# EAGLE schematic PIDController (EAGLE 8.7.1)
CNAME: Jamilla Akhund-Zade/de Bivort Lab
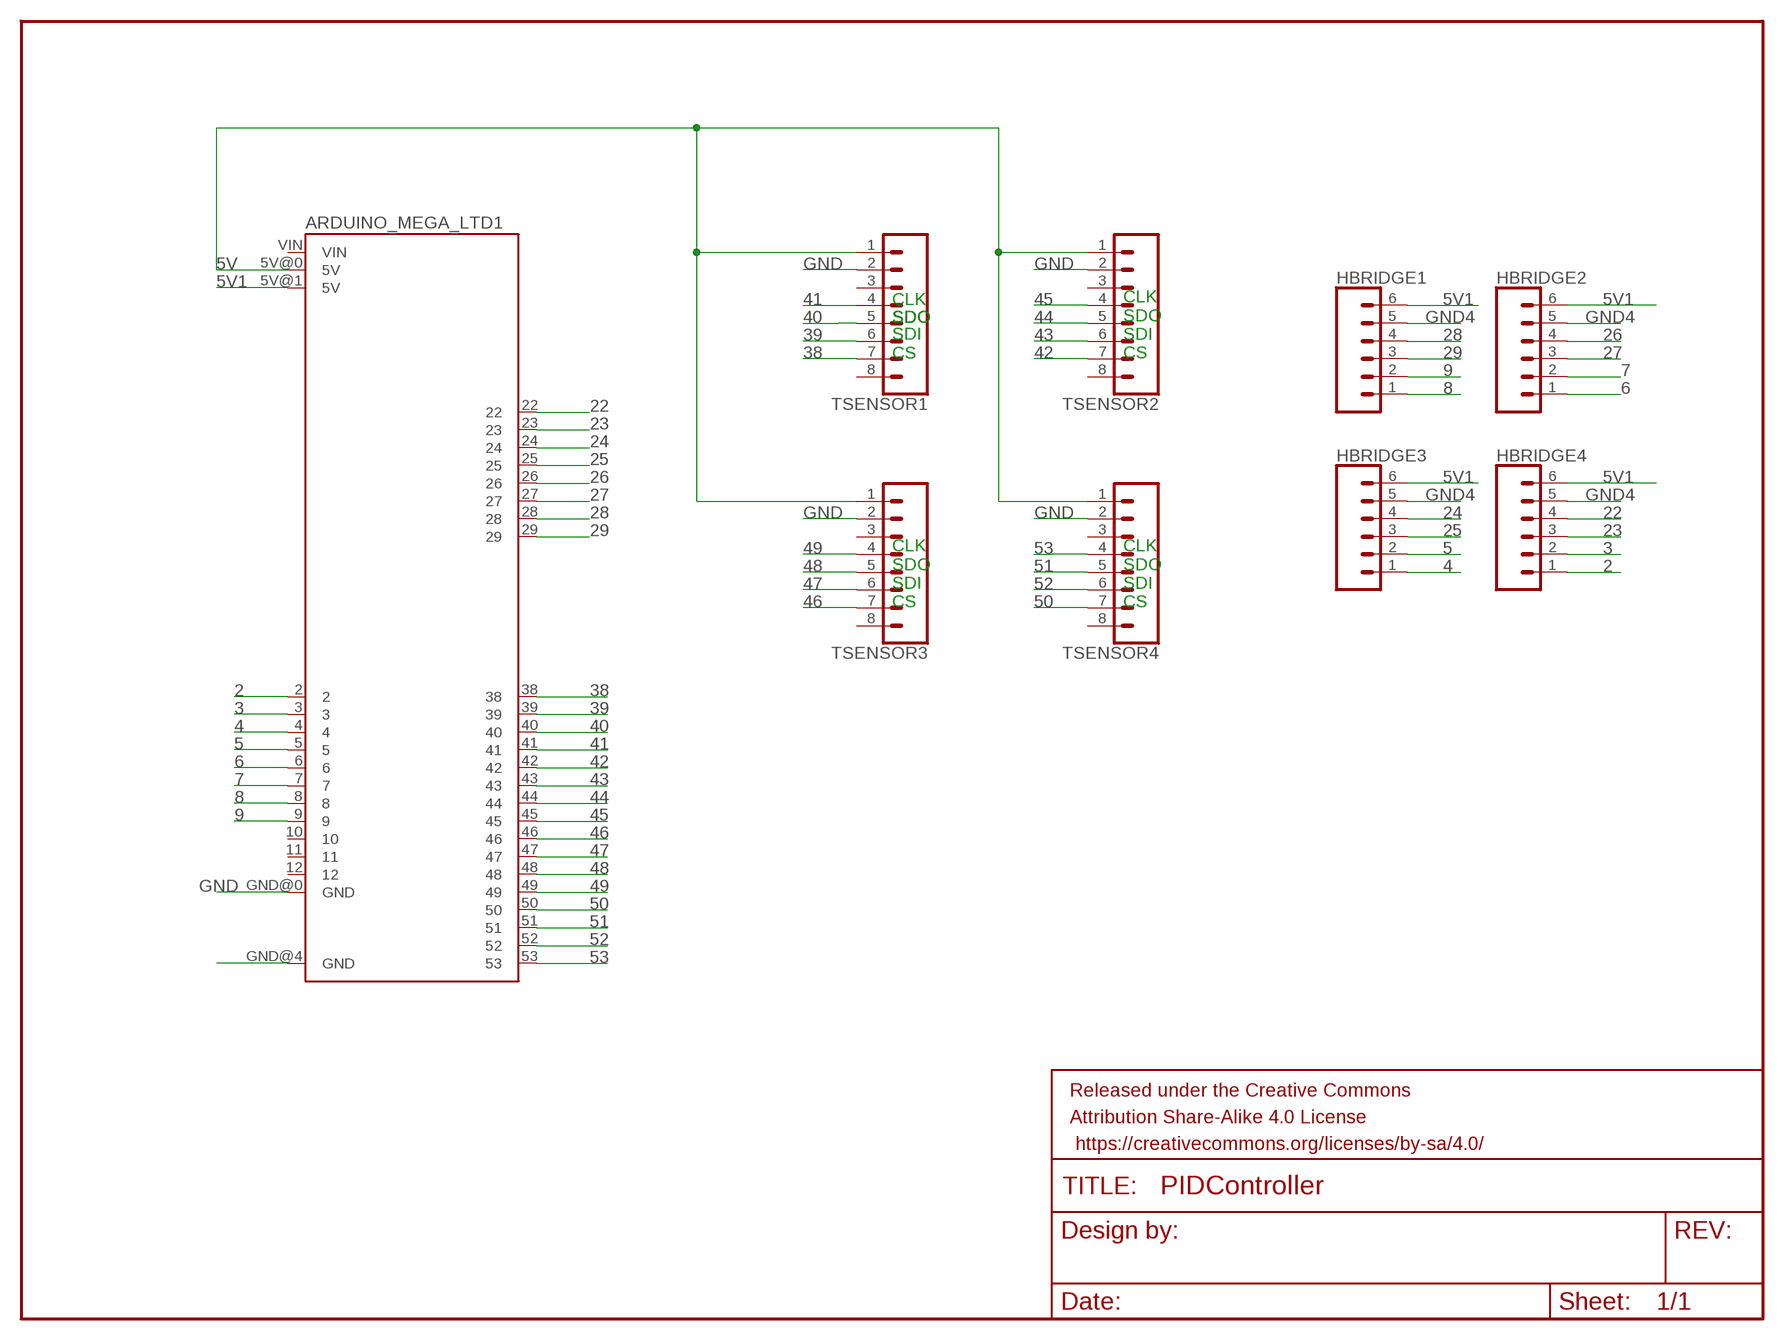
[diagram p0: schematic, sheet 1]

## Parts
ARDUINO_MEGA_LTD1  ARDUINO_MEGA_LTD  [ARDUINO_MEGA_LTD]
FRAME2  FRAME-LETTERNO_PACKAGE  [DUMMY]
HBRIDGE1  CONN_06LONGPADS  [1X06_LONGPADS]
HBRIDGE2  CONN_06LONGPADS  [1X06_LONGPADS]
HBRIDGE3  CONN_06LONGPADS  [1X06_LONGPADS]
HBRIDGE4  CONN_06LONGPADS  [1X06_LONGPADS]
TSENSOR1  CONN_08"  [1X08]
TSENSOR2  CONN_08"  [1X08]
TSENSOR3  CONN_08"  [1X08]
TSENSOR4  CONN_08"  [1X08]

## Nets
2: ARDUINO_MEGA_LTD1.2 HBRIDGE4.1
3: ARDUINO_MEGA_LTD1.3 HBRIDGE4.2
4: ARDUINO_MEGA_LTD1.4 HBRIDGE3.1
5: ARDUINO_MEGA_LTD1.5 HBRIDGE3.2
5V: ARDUINO_MEGA_LTD1.5V@0(5V) TSENSOR1.1 TSENSOR2.1 TSENSOR3.1 TSENSOR4.1
5V1: ARDUINO_MEGA_LTD1.5V@1(5V) HBRIDGE1.6 HBRIDGE2.6 HBRIDGE3.6 HBRIDGE4.6
6: ARDUINO_MEGA_LTD1.6 HBRIDGE2.1
7: ARDUINO_MEGA_LTD1.7 HBRIDGE2.2
8: ARDUINO_MEGA_LTD1.8 HBRIDGE1.1
9: ARDUINO_MEGA_LTD1.9 HBRIDGE1.2
22: ARDUINO_MEGA_LTD1.22 HBRIDGE4.4
23: ARDUINO_MEGA_LTD1.23 HBRIDGE4.3
24: ARDUINO_MEGA_LTD1.24 HBRIDGE3.4
25: ARDUINO_MEGA_LTD1.25 HBRIDGE3.3
26: ARDUINO_MEGA_LTD1.26 HBRIDGE2.4
27: ARDUINO_MEGA_LTD1.27 HBRIDGE2.3
28: ARDUINO_MEGA_LTD1.28 HBRIDGE1.4
29: ARDUINO_MEGA_LTD1.29 HBRIDGE1.3
38: ARDUINO_MEGA_LTD1.38 TSENSOR1.7
39: ARDUINO_MEGA_LTD1.39 TSENSOR1.6
40: ARDUINO_MEGA_LTD1.40 TSENSOR1.5
41: ARDUINO_MEGA_LTD1.41 TSENSOR1.4
42: ARDUINO_MEGA_LTD1.42 TSENSOR2.7
43: ARDUINO_MEGA_LTD1.43 TSENSOR2.6
44: ARDUINO_MEGA_LTD1.44 TSENSOR2.5
45: ARDUINO_MEGA_LTD1.45 TSENSOR2.4
46: ARDUINO_MEGA_LTD1.46 TSENSOR3.7
47: ARDUINO_MEGA_LTD1.47 TSENSOR3.6
48: ARDUINO_MEGA_LTD1.48 TSENSOR3.5
49: ARDUINO_MEGA_LTD1.49 TSENSOR3.4
50: ARDUINO_MEGA_LTD1.50 TSENSOR4.7
51: ARDUINO_MEGA_LTD1.51 TSENSOR4.5
52: ARDUINO_MEGA_LTD1.52 TSENSOR4.6
53: ARDUINO_MEGA_LTD1.53 TSENSOR4.4
GND: ARDUINO_MEGA_LTD1.GND@0(GND) TSENSOR1.2 TSENSOR2.2 TSENSOR3.2 TSENSOR4.2
GND4: ARDUINO_MEGA_LTD1.GND@4(GND) HBRIDGE1.5 HBRIDGE2.5 HBRIDGE3.5 HBRIDGE4.5
Unconnected: ARDUINO_MEGA_LTD1.10 ARDUINO_MEGA_LTD1.11 ARDUINO_MEGA_LTD1.12 ARDUINO_MEGA_LTD1.VIN TSENSOR1.3 TSENSOR1.8 TSENSOR2.3 TSENSOR2.8 TSENSOR3.3 TSENSOR3.8 TSENSOR4.3 TSENSOR4.8

## Notes on the sheet
- CLK
- SDO | SDO
- SDI
  CS
- CLK
  SDO
  SDI
  CS
- CLK
  SDO
  SDI
  CS
- CLK
  SDO
  SDI
  CS

## Library data of the parts
ARDUINO_MEGA_LTD1 = Arduino_Mega_LTD:ARDUINO_MEGA_LTD
FRAME2 = SparkFun-Aesthetics:FRAME-LETTER: Schematic Frame - Letter Standard 8.5x11 US Letter frame; DESIGNER: Jamilla Akhund-Zade, de Bivort Lab; VERSION: v01
HBRIDGE1-HBRIDGE4 = SparkFun-Connectors:CONN_06: Multi connection point. Often used as Generic Header-pin footprint for 0.1 inch spaced/style header connections On any of the 0.1 inch spaced packages, you can populate with these: Break Away Headers - Straight <https://www.sparkfun.com/products/116> (PRT-00116) Break Away Male Headers - Right Angle <https://www.sparkfun.com/products/553> (PRT-00553) Female Headers <https://www.sparkfun.com/products/115> (PRT-00115) Break Away Headers - Machine Pin <https://www.sparkfun.com/products/117> (PRT-00117) Break Away Female Headers - Swiss Machine Pin <https://www.sparkfun.com/products/743> (PRT-00743) Arduino Stackable Header - 6 Pin <https://www.sparkfun.com/products/9280> (PRT-09280) For SCREWTERMINALS and SPRING TERMINALS visit here: Screw Terimnals on SparkFun.com <https://www.sparkfun.com/search/results?term=Screw+Terminals> (5mm/3.5mm/2.54mm spacing) This device is also useful as a general connection point to wire up your design to another part of your project. Our various solder wires solder well into these plated through hole pads. Hook-Up Wire - Assortment (Stranded, 22 AWG) <https://www.sparkfun.com/products/11375> (PRT-11375) Hook-Up Wire - Assortment (Solid Core, 22 AWG) <https://www.sparkfun.com/products/11367> (PRT-11367) View the entire wire category on our website here <https://www.sparkfun.com/categories/141>
TSENSOR1-TSENSOR4 = SparkFun-Connectors:CONN_08: Multi connection point. Often used as Generic Header-pin footprint for 0.1 inch spaced/style header connections On any of the 0.1 inch spaced packages, you can populate with these: Break Away Headers - Straight <https://www.sparkfun.com/products/116> (PRT-00116) Break Away Male Headers - Right Angle <https://www.sparkfun.com/products/553> (PRT-00553) Female Headers <https://www.sparkfun.com/products/115> (PRT-00115) Break Away Headers - Machine Pin <https://www.sparkfun.com/products/117> (PRT-00117) Break Away Female Headers - Swiss Machine Pin <https://www.sparkfun.com/products/743> (PRT-00743) Arduino Stackable Header - 8 Pin <https://www.sparkfun.com/products/9279> (PRT-09279) For SCREWTERMINALS and SPRING TERMINALS visit here: Screw Terimnals on SparkFun.com <https://www.sparkfun.com/search/results?term=Screw+Terminals> (5mm/3.5mm/2.54mm spacing) This device is also useful as a general connection point to wire up your design to another part of your project. Our various solder wires solder well into these plated through hole pads. Hook-Up Wire - Assortment (Stranded, 22 AWG) <https://www.sparkfun.com/products/11375> (PRT-11375) Hook-Up Wire - Assortment (Solid Core, 22 AWG) <https://www.sparkfun.com/products/11367> (PRT-11367) View the entire wire category on our website here <https://www.sparkfun.com/categories/141> Special notes: Molex polarized connector foot print use with SKU : PRT-08231 with associated crimp pins and housings. 1MM SMD Version SKU: PRT-10208 NOTES ON THE VARIANTS LOCK and LOCK_LONGPADS... This footprint was designed to help hold the alignment of a through-hole component (i.e. 6-pin header) while soldering it into place. You may notice that each hole has been shifted either up or down by 0.005 of an inch from it's more standard position (which is a perfectly straight line). This slight alteration caused the pins (the squares in the middle) to touch the edges of the holes. Because they are alternating, it causes a "brace" to hold the component in place. 0.005 has proven to be the perfect amount of "off-center" position when using our standard breakaway headers. Although looks a little odd when you look at the bare footprint, once you have a header in there, the alteration is very hard to notice. Also,if you push a header all the way into place, it is covered up entirely on the bottom side.; PROD_ID: CONN-08438